# Altium project RobotShield.PrjPcb
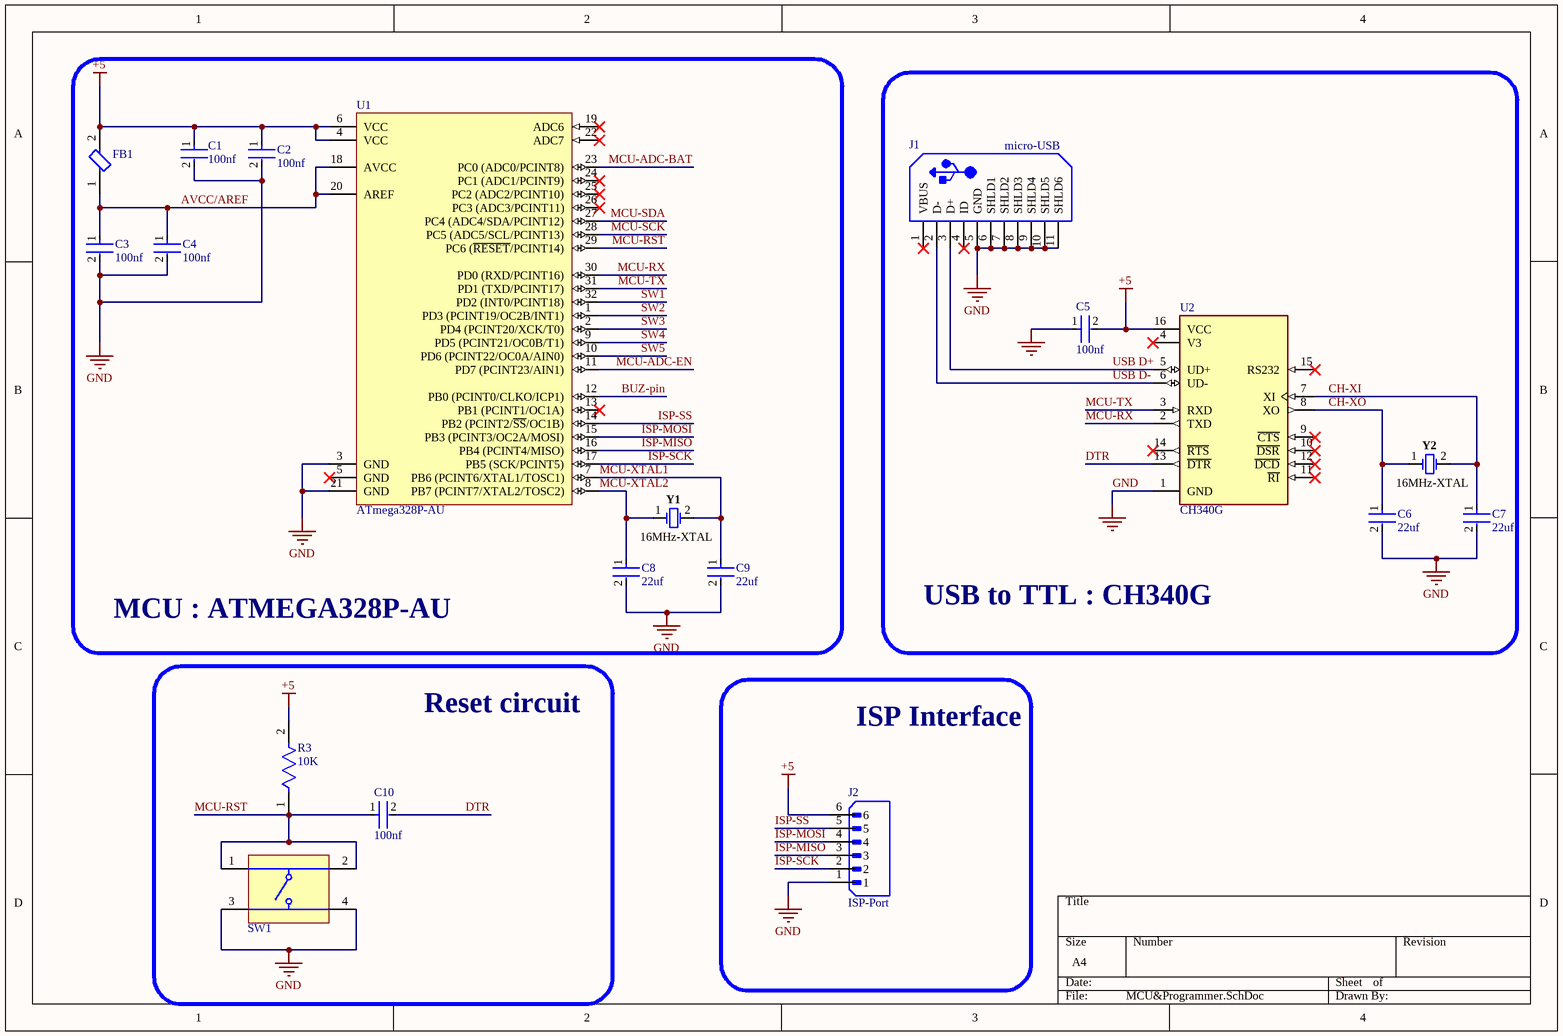
[diagram p0: MCU&Programmer.SchDoc]
3 sheets, 66 parts. Net scope: global (net labels, ports and power ports of the same name join across sheets).
Board file: RobotShield-PCB.PcbDoc
Sheets:
  MCU&Programmer.SchDoc
  Power-Supply.SchDoc
  peripherals.SchDoc

## Sheet MCU&Programmer.SchDoc
size A4; SheetNumber: 1; SheetTotal: 3

### Parts
C1  100nf  [FP-CC0805-0_85-MFG]
C2  100nf  [FP-CC0805-0_85-MFG]
C3  100nf  [FP-CC0805-0_85-MFG]
C4  100nf  [FP-CC0805-0_85-MFG]
C5  100nf  [FP-CC0805-0_85-MFG]
C6  22uf  [FP-CC0805-0_85-MFG]
C7  22uf  [FP-CC0805-0_85-MFG]
C8  22uf  [FP-CC0805-0_85-MFG]
C9  22uf  [FP-CC0805-0_85-MFG]
C10  100nf  [FP-CC0805-0_85-MFG]
FB1  (no value)  [FP-BLM21-0_2-t0_85-e0_5-IPC_B]
J1  micro-USB  [USB-MICRO-B_V]
J2  ISP-Port  [JST_B6B-XH-A(LF)(SN)]
R3  10K  [FP-CRCW0805-e3-MFG]
SW1  FSM4JSMATR  [TECO-FSM4JSMATR_V]  (value not drawn)
U1  ATmega328P-AU  [32A_M]
U2  CH340G  [SOIC127P600X180-16N]
Y1  16MHz-XTAL  [FOX-FOXSLF160-20]
Y2  16MHz-XTAL  [FOX-FOXSLF160-20]

### Blocks framed on the sheet
MCU : ATMEGA328P-AU: C1-C4 C8 C9 FB1 U1 Y1
USB to TTL : CH340G: C5-C7 J1 U2 Y2
Reset circuit: C10 R3 SW1
ISP Interface: J2

### Nets
+5: C1.1 C2.1 C5.2 FB1.2 J2.6 R3.2 U1.4(VCC) U1.6(VCC) U2.16(VCC)
GND: C1.2 C2.2 C3.2 C4.2 C5.1 C6.2 C7.2 C8.2 C9.2 J1.5(GND) J1.6(SHLD1) J1.7(SHLD2) J1.8(SHLD3) J1.9(SHLD4) J1.10(SHLD5) J1.11(SHLD6) J2.1 SW1.3 SW1.4 U1.3(GND) U1.21(GND) U2.1(GND)
AVCC/AREF: C3.1 C4.1 FB1.1 U1.18(AVCC) U1.20(AREF)
BUZ-pin: U1.12(PB0_(PCINT0/CLKO/ICP1))
CH-XI: C7.1 U2.7(XI) Y2.2
CH-XO: C6.1 U2.8(XO) Y2.1
DTR: C10.2 U2.13(~{DTR})
ISP-MISO: J2.3 U1.16(PB4_(PCINT4/MISO))
ISP-MOSI: J2.4 U1.15(PB3_(PCINT3/OC2A/MOSI))
ISP-SCK: J2.2 U1.17(PB5_(SCK/PCINT5))
ISP-SS: J2.5 U1.14(PB2_(PCINT2/~{SS}/OC1B))
MCU-ADC-BAT: U1.23(PC0_(ADC0/PCINT8))
MCU-ADC-EN: U1.11(PD7_(PCINT23/AIN1))
MCU-RST: C10.1 R3.1 SW1.1 SW1.2 U1.29(PC6_(~{RESET}/PCINT14))
MCU-RX: U1.30(PD0_(RXD/PCINT16)) U2.2(TXD)
MCU-SCK: U1.28(PC5_(ADC5/SCL/PCINT13))
MCU-SDA: U1.27(PC4_(ADC4/SDA/PCINT12))
MCU-TX: U1.31(PD1_(TXD/PCINT17)) U2.3(RXD)
MCU-XTAL1: C9.1 U1.7(PB6_(PCINT6/XTAL1/TOSC1)) Y1.2
MCU-XTAL2: C8.1 U1.8(PB7_(PCINT7/XTAL2/TOSC2)) Y1.1
SW1: U1.32(PD2_(INT0/PCINT18))
SW2: U1.1(PD3_(PCINT19/OC2B/INT1))
SW3: U1.2(PD4_(PCINT20/XCK/T0))
SW4: U1.9(PD5_(PCINT21/OC0B/T1))
SW5: U1.10(PD6_(PCINT22/OC0A/AIN0))
USB D+: J1.3(D+) U2.5(UD+)
USB D-: J1.2(D-) U2.6(UD-)

Not connected (* = marked no-connect by the designer): J1 1(VBUS)* 4(ID)*; U1 5(GND)* 13(PB1_(PCINT1/OC1A))* 19(ADC6)* 22(ADC7)* 24(PC1_(ADC1/PCINT9))* 25(PC2_(ADC2/PCINT10))* 26(PC3_(ADC3/PCINT11))*; U2 4(V3)* 9(~{CTS})* 10(~{DSR})* 11(~{RI})* 12(~{DCD})* 14(~{RTS})* 15(RS232)*

### Library data of the parts
C1-C5 C10 = CMP-2100-03606-3: CAP CER 0.1UF 50V X7R 0805; Manufacturer Part Number: CC0805KRX7R9BB104; Manufacturer: Yageo; Tolerance: 0.1; Material: Ceramic; Device Class L1: Passive Components; ComponentLink2Description: Datasheet; Package: CC0805-0.85; Digikey Description: CAP CER 0.1UF 50V X7R 0805; Capacitance: 100 nF; Device Class L3: Ceramic Capacitors; Value: 100 nF; Temperature: -30°C to +85°C; Temperature Characteristic: X7R; Voltage Rating: 50 V; Height: 0.95mm; RoHS: TRUE; Ipc Land Pattern Name: CAPC200125X85; Device Class L2: Capacitors; Category: Cap; Temperature Range Low: -30°C; Temperature Range High: +85°C; Mouser Description: Multilayer Ceramic Capacitors MLCC - SMD/SMT 100nF 50V X7R 10%; Footprint Url: http://www.yageo.com/exep/pages/download/literatures/UPY-C_GEN_24.pdf; Automotive: No; Octopart: https://octopart.com/cc0805krx7r9bb104-yageo-192993; Lead Free: Yes; ComponentLink2URL: http://www.yageo.com/documents/recent/UPY-GPHC_Y5V_6.3V-to-50V_8.pdf
C6-C9 = CMP-2100-03606-3: CAP CER 0.1UF 50V X7R 0805; Manufacturer Part Number: CC0805KRX7R9BB104; Manufacturer: Yageo; Tolerance: 0.1; Capacitance: 100 nF; Value: 100 nF; Material: Ceramic; Device Class L1: Passive Components; ComponentLink2Description: Datasheet; Package: CC0805-0.85; Digikey Description: CAP CER 0.1UF 50V X7R 0805; Device Class L3: Ceramic Capacitors; Temperature: -30°C to +85°C; Temperature Characteristic: X7R; Voltage Rating: 50 V; Height: 0.95mm; RoHS: TRUE; Ipc Land Pattern Name: CAPC200125X85; Device Class L2: Capacitors; Category: Cap; Temperature Range Low: -30°C; Temperature Range High: +85°C; Mouser Description: Multilayer Ceramic Capacitors MLCC - SMD/SMT 100nF 50V X7R 10%; Footprint Url: http://www.yageo.com/exep/pages/download/literatures/UPY-C_GEN_24.pdf; Automotive: No; Octopart: https://octopart.com/cc0805krx7r9bb104-yageo-192993; Lead Free: Yes; ComponentLink2URL: http://www.yageo.com/documents/recent/UPY-GPHC_Y5V_6.3V-to-50V_8.pdf
FB1 = CMP-0686-00610-3: Chip Ferrite Bead, 0805, 220Ω @ 100MHz, 0.045Ω, 25%, 2A; Number of Circuits: 1; Shielding: Unshielded; DC Resistance (DCR): 45mR; Impedance: 220R; Radiation Hardening: No; Material: Ferrite; Frequency: 100MHz; Width: 1.25mm; DC Current: 2A; Max DC Current: 2A; Number of Lines: 1; Package Quantity: 1; Case Code (Metric): 2012; Current Rating: 2A; Case/Package: 0805; Current: 2A; Military Standard: Not; Core Material: Ferrite; Depth: 1.25mm; Contact Plating: Tin; DC Resistance-Max: 45mR; Max Operating Temperature: 125°C; Length: 2mm; Max Current Rating: 2A; REACH SVHC: No SVHC; Termination: SMD/SMT; Min Operating Temperature: -55°C; Series: BLM21P; Test Frequency: 100MHz; Tolerance: 25%; Number of Pins: 2; RoHS Compliant: Yes; Height: 0.85mm; Packaging: Tape and Reel; Lead Free: Lead Free; Case Code (Imperial): 0805
J1 = CMP-2000-05827-1: Micro-USB B Receptacle, Right Angle, Bottom Mount, Surface Mount, with Solder Tabs, -30 to 85 degC, 5-Pin USB, RoHS, Tape and Reel; Manufacturer: Molex; Featured Product: Micro-USBConnectorsUSBConnectors; Other Names: WM1399DKR; Package Version: Rev. F, 12/2012; Number of Contacts: 5; Connector Type: USB-microB; Catalog Drawings: 1050170001; 3D Model: 105017-0001.stp; Mating Products: WM17145-ND-CABLEMICROUSBBTOSTDA1.0MWM17147-ND-CABLEMICROUSBBTOSTDA2.0MWM17146-ND-CABLEMICROUSBBTOSTDA1.5M; PCN Assembly/Origin: ResinSupplier21/Oct/2015; Voltage - Max: 30V; Online Catalog: Molex-MicroUSB; Manufacturer URL: http://www.molex.com/; Package Description: 5-Leads USB, Micro B, Body 7.5 x 5 mm, Pitch 0.65 mm; Datasheet URL: http://www.molex.com/elqNow/elqRedir.htm?ref=http://www.molex.com/webdocs/datasheets/pdf/en-us/1050170001_IO_CONNECTORS.pdf; Ingress Protection: -; Datasheet Version: 03/2016; Mounting Type: BoardCutout,SurfaceMount,RightAngle; Circuits: 5; Standard Package: 1; Package Reference: MICRO-B; Package URL: http://www.molex.com/pdm_docs/sd/1050170001_sd.pdf; Category: Connectors,Interconnects; Series: -; RoHS Information: 1050170001CertofCompliance; Features: Shielded,SolderRetention; Family: USB,DVI,HDMIConnectors; Specifications: -; Gender: Receptacle; Packaging: Digi-Reel®; Mounting Technology: SurfaceMount
J2 = B6B-XH-A(LF)(SN): Connector Header Through Hole 6 position 0.098 (2.50mm); MF: JST Sales; SnapEDA_Link: https://www.snapeda.com/parts/B6B-XH-A(LF)(SN)/JST+Sales+America+Inc./view-part/?ref=snap; Package: None; Value: *; MP: B6B-XH-A(LF)(SN); Check_prices: https://www.snapeda.com/parts/B6B-XH-A(LF)(SN)/JST+Sales+America+Inc./view-part/?ref=eda
R3 = CMP-2001-04899-2: RES Thick Film, 100kΩ, 1%, 0.125W, 100ppm/°C, 0805; Resistance: 100kR; Power Rating: 125mW; Voltage Rating: 150V; Case/Package: 0805; Max Operating Temperature: 155°C; Case Code (Imperial): 0805; Lead Free: Lead Free; Weight: 0.000194oz; Number of Pins: 2; Package Quantity: 5000; Height: 0.45mm; Composition: Thick Film; Military Standard: Not; Tolerance: 1%; Case Code (Metric): 2012; Termination: SMD/SMT; Mount: Surface Mount; Radiation Hardening: No; Width: 1.25mm; Length: 2mm; Depth: 1.25mm; Packaging: Tape and Reel; Min Operating Temperature: -55°C; Contact Plating: Tin; Temperature Coefficient: 100ppm/°C; Voltage Rating (DC): 150V
SW1 = CMP-2000-07486-1: Micro Miniature Push Button Switch FSM JSM, 50 mA, -35 to 85 degC, 4-Pin SMD, RoHS, Tape and Reel; Manufacturer: TE Connectivity; Mechanical Life: 100000Cycles; Current Rating: 50mA; Actuator Material: Polyamide; Max Voltage Rating (DC): 12V; Capacitance: 0f; Illumination Type: Illuminated; Voltage Rating (DC): 24V; Case\/Package: SMD/SMT; Operating Force: 160gf; Contact Resistance: 100mOhm; Actuator Length: 0.055inch; Switch Travel: 0.25mm; Throw Configuration: SPST; Termination: GullWing; Contact Plating: Silver; Orientation: Straight; Mounting Technology: SurfaceMount; REACH SVHC: Unknown; Electrical Life: 100000Cycles; Package Reference: FSM4JSMATR; Max Operating Temperature: 85degC; Manufacturer URL: http://www.te.com/; Package Description: 4-Pin Surface Mount Device, Body 6 x 6 mm, Pitch 4.5 mm; Datasheet Version: Rev. V, 02/2015; Packaging: TapeandReel; Min Operating Temperature: -35degC; Mount: SurfaceMount; Contact Current Rating: 50mA; Contact Material: CopperAlloy; Package Quantity: 1200; Datasheet URL: http://www.te.com/commerce/DocumentDelivery/DDEController?Action=showdoc&DocId=Customer+Drawing%7F2-1437565-7%7FV%7Fpdf%7FEnglish%7FENG_CD_2-1437565-7_V.pdf%7F4-1437565-2; RoHSCompliant: true
U1 = CMP-0095-00269-2: 8-bit AVR Microcontroller, 32KB Flash, 1KB EEPROM, 2KB SRAM, 32-pin TQFP, Industrial Grade (-40°C to 85°C); PackageDescription: 32-Lead, 7x7x1.0 mm Body, 0.8mm Lead Pitch, Thin Profile Plastic Quad Flat Package (TQFP); DatasheetVersion: revD, May-2011; RevisionNote: DatasheetVersion & PackageVersion updated. URLs added.; ComponentLink1URL: http://www.atmel.com/; ComponentLink2Description: ATmega48A/48PA/88A/88PA/168A/168PA/328/328P Datasheet; Code_JEDEC: MS-026-ABA; ComponentLink1Description: Manufacturer URL; PackageReference: 32A; ComponentLink3Description: ATmega48A/48PA/88A/88PA/168A/168PA/328/328P Summary; ComponentLink2URL: http://www.atmel.com/dyn/resources/prod_documents/doc8271.pdf; PackageVersion: revC, Oct-2010; ComponentLink3URL: http://www.atmel.com/dyn/resources/prod_documents/8271S.pdf
U2 = CH340G: USB Interface Integrated Circuit; MF: WCH; Value: *; SnapEDA_Link: https://www.snapeda.com/parts/Ch340G/WCH/view-part/?ref=snap; MP: Ch340G; Check_prices: https://www.snapeda.com/parts/Ch340G/WCH/view-part/?ref=eda; Availability: Not in stock; Price: None; Package: None
Y1 Y2 = CMP-1749-00003-1: Resistance Weld Thru-Hole Crystal, 16 MHz, -20 to 70 degC, 2-Pin THD, RoHS, Bulk; Voltage Rating: 250 V; Tolerance: 1%; Resistance: 221 kohm; Case\Package: Axial; Power Rating: 250 mW; RoHSCompliant: true; Package Quantity: 200; Packaging: Bulk; Min Operating Temperature: -55 degC; DatasheetVersion: Mar-15; ComponentLink1URL: http://www.foxonline.com/; Max Operating Temperature: 155 degC; PackageReference: FOXSLF160-20; Mount: Through Hole; PackageDescription: 2-Pin Through Hole Device, Body 11.35 x 4.65 mm; ComponentLink1Description: Manufacturer URL; ComponentLink2URL: http://www.foxonline.com/pdfs/hc49slf.pdf; ComponentLink2Description: Datasheet; Length: 0.248 inch

## Sheet Power-Supply.SchDoc
size A; SheetNumber: 2; SheetTotal: 3
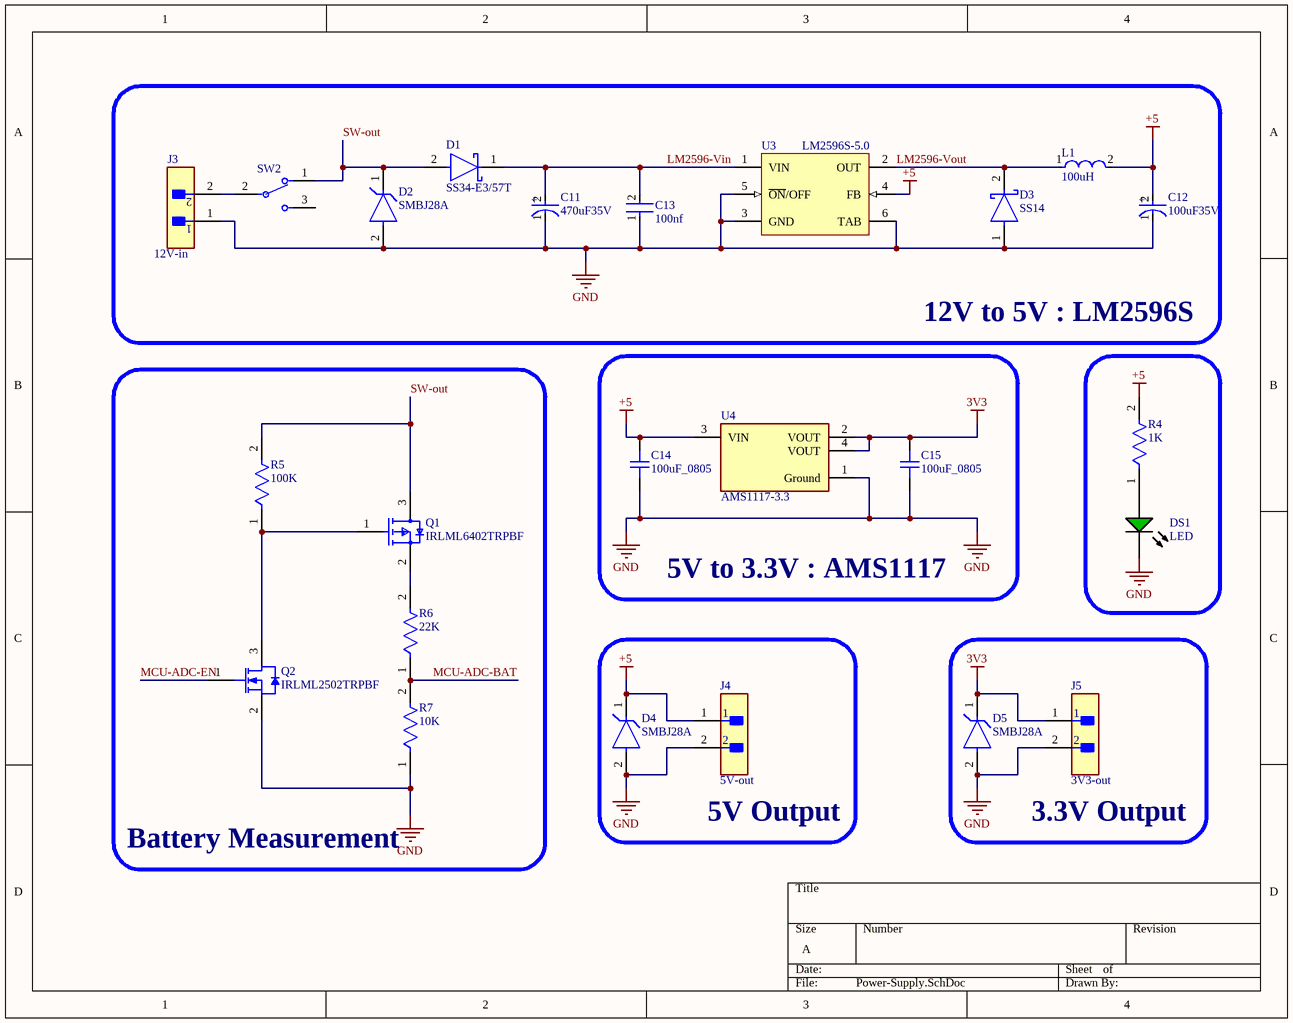
[diagram p1: Power-Supply.SchDoc]

### Parts
C11  470uF35V  [FP-RAD-TH-D_10_0_5-L_16_1-MFG]
C12  100uF35V  [FP-RAD-TH-D_10_0_5-L_16_1-MFG]
C13  100nf  [FP-CC0805-0_85-MFG]
C14  100uF_0805  [CAP_0805]
C15  100uF_0805  [CAP_0805]
D1  SS34-E3/57T  [FP-95402-MFG]
D2  SMBJ28A  [FP-SMBJ-MFG]
D3  SS14  [FP-403AE-MFG]
D4  SMBJ28A  [FP-SMBJ-MFG]
D5  SMBJ28A  [FP-SMBJ-MFG]
DS1  LED  [AVAG-HSMX-C170_V]
J3  12V-in  [FP-B2B-XH-A_LF_SN-MFG]
J4  5V-out  [FP-B2B-XH-A_LF_SN-MFG]
J5  3V3-out  [FP-B2B-XH-A_LF_SN-MFG]
L1  100uH  [FP-B82464G4-MFG]
Q1  IRLML6402TRPBF  [FP-Micro3-MFG]
Q2  IRLML2502TRPBF  [INTR-SOT-23-3_V]
R4  1K  [FP-CRCW0805-e3-MFG]
R5  100K  [FP-CRCW0805-e3-MFG]
R6  22K  [FP-CRCW0805-e3-MFG]
R7  10K  [FP-CRCW0805-e3-MFG]
SW2  JS102011SCQN  [FP-JS102011SCQN-MFG]  (value not drawn)
U3  LM2596S-5.0  [KTT0005B_M]
U4  AMS1117-3.3  [FP-AMS1117-IPC_C]

### Blocks framed on the sheet
12V to 5V : LM2596S: C11-C13 D1-D3 J3 L1 SW2 U3
Battery Measurement: Q1 Q2 R5-R7
5V to 3.3V : AMS1117: C14 C15 U4
5V Output: D4 J4
3.3V Output: D5 J5

### Nets
3V3: C15.2 D5.1(C) J5.1 U4.2(VOUT) U4.4(VOUT)
+5: C12.2(A) C14.2 D4.1(C) J4.1 L1.2 R4.2 U3.4(FB) U4.3(VIN)
GND: C11.1(C) C12.1(C) C13.1 C14.1 C15.1 D2.2(A) D3.1(A) D4.2(A) D5.2(A) DS1.2(K) J3.1 J4.2 J5.2 Q2.2(S) R7.1 U3.3(GND) U3.5(~{ON}/OFF) U3.6(TAB) U4.1(Ground)
LM2596-Vin: C11.2(A) C13.2 D1.1(C) U3.1(VIN)
LM2596-Vout: D3.2(C) L1.1 U3.2(OUT)
MCU-ADC-BAT: R6.1 R7.2
MCU-ADC-EN: Q2.1(G)
SW-out: D1.2(A) D2.1(C) Q1.3(D) R5.2 SW2.1
NetDS1_1: DS1.1(A) R4.1
NetJ3_2: J3.2 SW2.2(C)
NetQ1_1: Q1.1(G) Q2.3(D) R5.1
NetQ1_2: Q1.2(S) R6.2

Not connected (* = marked no-connect by the designer): SW2 3

### Notes on the sheet
- (in symbol CMP-05427-001499-1) +

### Library data of the parts
C11 C12 = CMP-05427-001499-1: Aluminum Electrolytic Capacitors (Radial Lead Type) AEC-Q200 Qualified 470uF ±20% 35V; Lead Diameter: 0.6mm; Lead/Base Style: Straight; Polarity: Polar; Life (Hours): 2000Hour; Ripple Current: 460mA; Tolerance: 20%; Termination: Radial; Contact Plating: Tin; Length: 16mm; Voltage Rating: 35V; Max Operating Temperature: 105°C; Construction: RADIAL; Voltage Rating (DC): 35V; Radiation Hardening: No; Packaging: Tape and Reel; Diameter: 10mm; Series: NHG; Case/Package: Radial; Mount: Through Hole; Lead Pitch: 5mm; Height: 16mm; RoHS Compliant: Yes; Height - Seated (Max): 0.669inch; Min Operating Temperature: -55°C; Package Quantity: 500; Capacitance: 470uF
C13 = CMP-2100-03606-3: as C1 on sheet MCU&Programmer; Device Class L1: Passive Components; ComponentLink2Description: Datasheet; Package: CC0805-0.85; Digikey Description: CAP CER 0.1UF 50V X7R 0805; Capacitance: 100 nF; Device Class L3: Ceramic Capacitors; Value: 100 nF; Temperature: -30°C to +85°C; Temperature Characteristic: X7R; Voltage Rating: 50 V; Height: 0.95mm; RoHS: TRUE; Ipc Land Pattern Name: CAPC200125X85; Device Class L2: Capacitors; Category: Cap; Temperature Range Low: -30°C; Temperature Range High: +85°C; Mouser Description: Multilayer Ceramic Capacitors MLCC - SMD/SMT 100nF 50V X7R 10%; Footprint Url: http://www.yageo.com/exep/pages/download/literatures/UPY-C_GEN_24.pdf; Automotive: No; Octopart: https://octopart.com/cc0805krx7r9bb104-yageo-192993; Lead Free: Yes; ComponentLink2URL: http://www.yageo.com/documents/recent/UPY-GPHC_Y5V_6.3V-to-50V_8.pdf
C14 C15 = CAP_0805_10V: Capacitor SMD 0805 10V
D1 = CMP-02539-000012-1: DIODE SCHOTTKY 40V 3A DO214AB; Manufacturer: Vishay; Max Junction Temp: +150°C; Peak Reverse Current: 0.5mA; Max Surge Forward Current: 100A; Standoff Height: 0mm; ComponentLink2Description: Datasheet; Device Class L3: Schottky Diodes; Height: 2.62mm; Max Repetitive Reverse Voltage: 40V; Lead Free: Yes; Package: 95402; Temperature Range High: +150°C; ComponentLink2URL: http://www.vishay.com/docs/88751/ss32.pdf; Temperature: -55°C to +150°C; Footprint Url: http://www.vishay.com/docs/95402/smc.pdf; Automotive: No; Forward Current: 3A; Category: Diode; Manufacturer Part Number: SS34-E3/57T; RoHS: TRUE; Device Class L2: Diodes; Mouser Description: Schottky Diodes & Rectifiers 3.0 Amp 40 Volt; Octopart: https://octopart.com/ss34-e3%2F57t-vishay-39552907; Temperature Range Low: -55°C; Device Class L1: Discrete Semiconductors; Digikey Description: DIODE SCHOTTKY 40V 3A DO214AB
D2 D4 D5 = CMP-08607-000081-1: TVS DIODE 28V 45.4V DO214AA; Manufacturer: Littelfuse Inc; Breakdown Voltage: 31.1V; Direction: Unidirectional; Number Of Channels: 1; Peak Pulse Power: 600W; Max Junction Temp: +150°C; Peak Pulse Current: 13.3A; Temperature: -65°C to +150°C; Category: Diode; RoHS: TRUE; Height: 2.61mm; Reverse Standoff Voltage: 28V; Device Class L1: Circuit Protection; Temperature Range Low: -65°C; ComponentLink2Description: Datasheet; Digikey Description: TVS DIODE 28V 45.4V DO214AA; Automotive: No; Package: SMBJ; Mouser Description: Littelfuse SMBJ28A, Uni-Directional TVS Diode, 600W, 2-Pin DO-214AA; ComponentLink2URL: https://www.littelfuse.com/~/media/electronics/datasheets/tvs_diodes/littelfuse_tvs_diode_smbj_datasheet.pdf.pdf; Manufacturer Part Number: SMBJ28A; Octopart: https://octopart.com/smbj28a-littelfuse-350790; Clamping Voltage: 45.4V; Temperature Range High: +150°C; Device Class L3: unset; Device Class L2: TVS Diodes; Lead Free: Yes
D3 = CMP-2000-04943-2: DIODE SCHOTTKY 40V 1A SMA; Manufacturer: ON Semiconductor; Peak Reverse Current: 0.2mA; Max Junction Temp: +125°C; Standoff Height: 0.05mm; Max Surge Forward Current: 40A; Mouser Description: Schottky Diodes & Rectifiers SMA 40V 1.0A; RoHS: TRUE; Lead Free: Yes; Manufacturer Part Number: SS14; Device Class L3: Schottky Diodes; Category: Diode; Automotive: No; Digikey Description: DIODE SCHOTTKY 40V 1A SMA; ComponentLink2Description: Datasheet; Device Class L2: Diodes; Height: 2.5mm; Temperature Range High: +125°C; ComponentLink2URL: https://www.onsemi.com/pub/Collateral/SS19-D.PDF; Device Class L1: Discrete Semiconductors; Package: 403AE; Octopart: https://octopart.com/ss14-on+semiconductor-29205033; Max Repetitive Reverse Voltage: 40V; Temperature Range Low: -65°C; Forward Current: 1A; Temperature: -65°C to +125°C
DS1 = CMP-2000-05062-1: Chip LED, Green, 2.2 V, -40 to 85 degC, 2-Pin SMD, Pb-Free, Tape and Reel; Manufacturer: Avago; No. of Pins: 2; Peak Wavelength: 570nm; SVHC: NoSVHC(16-Jun-2014); Dominant Wavelength: 572nm; Forward Current If: 20mA; Viewing Angle: 170deg; Lens Shape: Rectangular; PIV Max: 5V; External Width: 1.25mm; LED Type: Standard; External Depth: 0.8mm; Opto Mounting Orientation: Top; Luminous Intensity: 15mcd; Luminous Intensity Min: 4mcd; Forward Voltage VF Max: 2.6V; External Length / Height: 2mm; Bulb Size: 1.25mmx1.4mm; Light Area Height: 1mm; Voltage Vf Typ: 2.2V; Operating Temperature Max: 85degC; Datasheet Version: Oct-08; MSL: MSL2A-4weeks; Peak Forward Current: 20mA; Package Description: 2-Pin Surface Mount Device, Body 2 x 1.25 mm, Height 0.8 mm; Datasheet URL: https://datasheet.ciiva.com/29280/180495-da-01-en-chip-led-hsmg-c170-gelb-gruen-29280971.pdf; Storage Temperature Min: -40degC; LED Colour: Green; Wavelength Typ: 570nm; Mounting Type: SMD; Forward Current If Max: 20mA; Dominant Wavelength Typ: 572nm; LED Mounting: SMD; Operating Temperature Range: -30degCto+85degC; Operating Temperature Min: -30degC; Manufacturer URL: http://www.avagotech.com/; Packaging: CutTape; Luminous Intensity Typ: 15mcd; Package Reference: HSMX-C170; Storage Temperature Max: 85degC; Opto Case Style: SMD; Forward Voltage: 2.2V
J3-J5 = CMP-2000-05888-3: CONN HEADER VERT 2POS 2.5MM; Current Rating: 3A; Voltage Rating: 250V; Number of Contacts: 2; Contact Resistance: 20mR; Wire/Cable Gauge: 22AWG; Insulation Resistance: 1GR; Connector Type: Male Pin; Packaging: Bulk; Contact Material: Brass; Lead Free: Lead Free; Orientation: Straight; Contact Plating: Tin; Max Current Rating: 3A; Termination: Solder; Fastening Type: Detent; Depth: 5.75mm; Housing Material: Polyamide; REACH SVHC: No SVHC; Series: XH; Voltage Rating (AC): 250V; Number of Positions: 2; Color: Natural; Contact Type: Male Pin; Max Voltage Rating (DC): 250V; Pitch: 2.5mm; Lead Pitch: 2.5mm; Mount: Through Hole; Max Operating Temperature: 85°C; Length: 7.4mm; Max Voltage Rating (AC): 250V; Min Operating Temperature: -25°C; Number of Rows: 1; Housing Color: White
L1 = CMP-10464-000001-1: FIXED IND 68UH 1.3A 130 MOHM SMD; Manufacturer: EPCOS; Manufacturer Part Number: B82464G4683M000; Test Frequency: 100kHz; Automotive Grade: Grade 0; Series Resistance: 0.13Ω; Tolerance: 20%; Core Material: Ferrite; Saturation Current: 1.45A; Standoff Height: 0.21mm; Shielding: true; Temperature Range High: +150°C; ComponentLink2Description: Datasheet; Category: Ind; Height: 4.8mm; Device Class L1: Passive Components; Octopart: https://octopart.com/b82464g4683m000-epcos-23277316; Value: 68uH; RoHS: TRUE; Composition: Wirewound; Temperature: -55°C to +150°C; Inductance: 68uH; Package: B82464G4; Device Class L3: Fixed Inductors; Temperature Range Low: -55°C; Automotive: Yes; ComponentLink2URL: https://www.tdk-electronics.tdk.com/inf/30/db/ind_2008/b82464g4.pdf; Lead Free: Yes; Device Class L2: Inductors; Digikey Description: FIXED IND 68UH 1.3A 130 MOHM SMD; Rms Current: 1.3A
Q1 = CMP-32901-000130-1: MOSFET P-CH 20V 3.7A SOT-23; Manufacturer: Infineon; Reverse Recovery Time: 29ns; Max Forward Diode Voltage: -1.2V; Input Capacitace At Vds: 633pF @ -10V; Drain To Source Resistance: 0.05Ω; Gate To Source Voltage: 12V; Max Junction Temp: +150°C; Pulse Drain Current: -22A; Threshold Vgs Min: -0.4V; Turn Off Delay Time: 588ns; Number Of Channels: 1; Power Dissipation: 1.3W; Turn On Delay Time: 350ns; Drain To Source Breakdown Voltage: -20V; Continuous Drain Current: -3.7A; Depletion Mode: False; Gate Charge At Vgs: 8nC @ -5V; Rthja Max: 75°C/W; Threshold Vgs: -0.55V; Standoff Height: 0.01mm; Reverse Recovery Charge: 11nC; Device Class L2: Transistors; Ipc Land Pattern Name: SOT95P237X100-3; Temperature Range High: +150°C; Octopart: https://octopart.com/irlml6402trpbf-infineon-65874989; ComponentLink2URL: https://www.infineon.com/dgdl/irlml6402pbf.pdf?fileId=5546d462533600a401535668d5c2263c; Automotive: No; Manufacturer Part Number: IRLML6402TRPBF; Height: 1.12mm; Drain To Source Voltage: -20V; Digikey Description: MOSFET P-CH 20V 3.7A SOT-23; Device Class L1: Discrete Semiconductors; Package: Micro3; Lead Free: Yes; Temperature Range Low: -55°C; Number Of P Channels: 1; Technology: MOSFET; Temperature: -55°C to +150°C; Category: Trans; Footprint Url: http://irf.com/package/outline/po_micro3.pdf; RoHS: TRUE; Device Class L3: MOSFETs; Threshold Vgs Max: -1.2V; ComponentLink2Description: Datasheet
Q2 = CMP-2000-04985-1: N-Channel HEXFET(R) Power MOSFET, 20 V VDS, +/- 12 V VGS, 4.2 A, 3-Pin SOT23, RoHS, Tape and Reel; Manufacturer: International Rectifier; Drain-to-Source Voltage [Vdss]: 20V; Drain-Source On Resistance-Max: 0.045O; Qg Gate Charge: 8nC; Rated Power Dissipation: 1.25W; Package Reference: SOT-23-3; Manufacturer URL: http://internationalrectifier.com/; Package Description: 3-Pin Small Outline Transistor, Body 2.92 x 1.3 mm, Pitch 0.95 mm; Datasheet Version: Apr-14; Channel Type: N-Channel; Datasheet URL: https://datasheet.ciiva.com/6383/irlml2502pbf-6383216.pdf
R4-R7 = CMP-2001-04899-2: as R3 on sheet MCU&Programmer; Case/Package: 0805; Max Operating Temperature: 155°C; Case Code (Imperial): 0805; Lead Free: Lead Free; Weight: 0.000194oz; Number of Pins: 2; Package Quantity: 5000; Height: 0.45mm; Composition: Thick Film; Military Standard: Not; Tolerance: 1%; Case Code (Metric): 2012; Termination: SMD/SMT; Mount: Surface Mount; Radiation Hardening: No; Width: 1.25mm; Length: 2mm; Depth: 1.25mm; Packaging: Tape and Reel; Min Operating Temperature: -55°C; Contact Plating: Tin; Temperature Coefficient: 100ppm/°C; Voltage Rating (DC): 150V
SW2 = CMP-10038-000023-1: SWITCH SLIDE SPDT 300MA 6V; Electrical Life: 5000Cycles; Actuator Type: Standard; Contact Resistance: 70mR; Actuator Material: Nylon; Max Voltage Rating (DC): 30V; Actuator Length: 2mm; Switch Function: On-On; Actuator Color: Black; Radiation Hardening: No; Throw Configuration: SPDT; Depth: 7.5mm; Case/Package: SMD/SMT; Package Quantity: 4000; Min Operating Temperature: -40°C; Length: 8.5mm; Current Rating: 300mA; Mount: Surface Mount; Voltage Rating (DC): 6V; RoHS Compliant: Yes; Orientation: Straight; Housing Material: Nylon; Contact Plating: Silver; Max Operating Temperature: 85°C; Packaging: Tape and Reel; Switch Travel: 2mm; Max Current Rating: 300mA; Contact Material: Copper Alloy; Series: JS; Termination: Gull Wing
U3 = CMP-0069-00269-3: SIMPLE SWITCHER® Power Converter 150 KHz 3A Step-Down Voltage Regulator, 5-pin TO-263, Pb-Free; Manufacturer: Texas Instruments; PowerWise: N; PackageTopMarking: NSUZXYTTE#*LM2596S*-5.0 P+; ComponentLink1URL: http://www.ti.com/general/docs/lit/getliterature.tsp?genericPartNumber=LM2596&fileType=pdf; PackageDescription: TO-263, Molded, .400 x .390 x .180in, 5 Lead, .067in Pitch, Surface Mount; RoHS: Y; PinCount: 5; Code_JEDEC: MO-169-AB; ComponentLink1Description: Datasheet URL; PackageReference: KTT0005B; CompType: Switcher
U4 = CMP-209535-000001-1: LDO Voltage Regulators 1A, 3.3V; Manufacturer: Advanced Monolithic Systems; Dropout Voltage: 1.1V; Output Type: Fixed; Nominal Supply Current: 5mA; Max Power Dissipation: 1.2W; Max Supply Voltage: 15V; Number Of Outputs: 1; Standoff Height: 0.64mm; Max Junction Temp: +125°C; Height: 1.8mm; Package: AMS1117; Device Class L2: Power Management ICs; ComponentLink2Description: Datasheet; ComponentLink2URL: http://www.advanced-monolithic.com/pdf/ds1117.pdf; Category: IC; RoHS: TRUE; Automotive: No; Device Class L1: Integrated Circuits (ICs); Output Current: 1A; Device Class L3: Voltage Regulators - Linear; Temperature: -40°C to +125°C; Output Voltage: 3.3V; Manufacturer Part Number: AMS1117-3.3; Temperature Range Low: -40°C; Octopart: https://octopart.com/ams1117-3.3-advanced+monolithic+systems-25899300; Lead Free: Yes; Ipc Land Pattern Name: SOT229P700X180-4; Temperature Range High: +125°C

## Sheet peripherals.SchDoc
size A; SheetNumber: 3; SheetTotal: 3
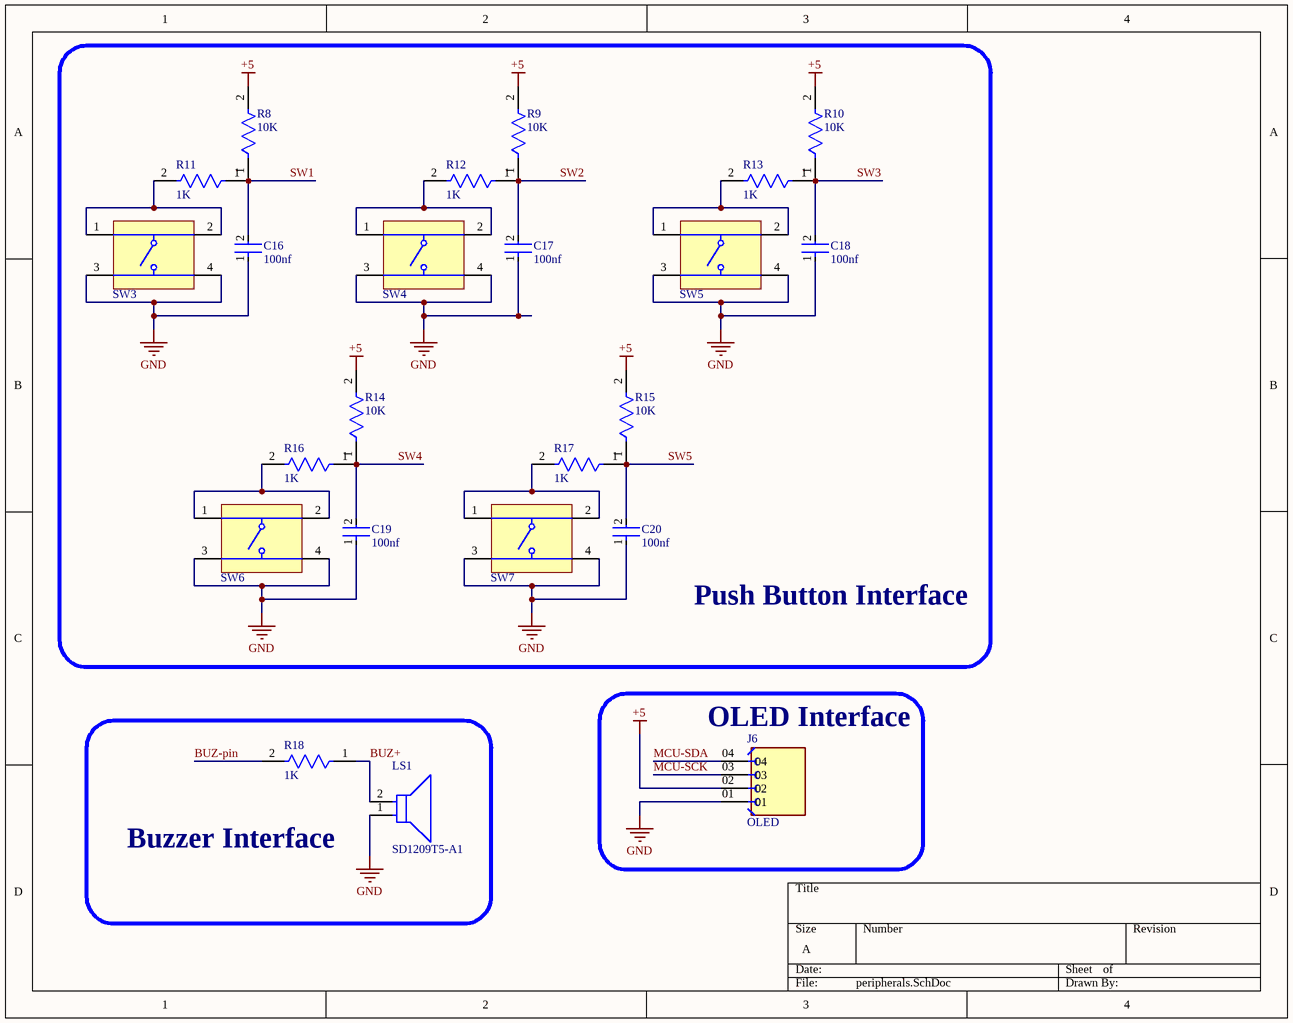
[diagram p2: peripherals.SchDoc]

### Parts
C16  100nf  [FP-CC0805-0_85-MFG]
C17  100nf  [FP-CC0805-0_85-MFG]
C18  100nf  [FP-CC0805-0_85-MFG]
C19  100nf  [FP-CC0805-0_85-MFG]
C20  100nf  [FP-CC0805-0_85-MFG]
J6  OLED  [AMPHENOL_75915-804]
LS1  SD1209T5-A1  [FP-SD1209-MFG]
R8  10K  [FP-CRCW0805-e3-MFG]
R9  10K  [FP-CRCW0805-e3-MFG]
R10  10K  [FP-CRCW0805-e3-MFG]
R11  1K  [FP-CRCW0805-e3-MFG]
R12  1K  [FP-CRCW0805-e3-MFG]
R13  1K  [FP-CRCW0805-e3-MFG]
R14  10K  [FP-CRCW0805-e3-MFG]
R15  10K  [FP-CRCW0805-e3-MFG]
R16  1K  [FP-CRCW0805-e3-MFG]
R17  1K  [FP-CRCW0805-e3-MFG]
R18  1K  [FP-CRCW0805-e3-MFG]
SW3  FSM4JSMATR  [TECO-FSM4JSMATR_V]  (value not drawn)
SW4  FSM4JSMATR  [TECO-FSM4JSMATR_V]  (value not drawn)
SW5  FSM4JSMATR  [TECO-FSM4JSMATR_V]  (value not drawn)
SW6  FSM4JSMATR  [TECO-FSM4JSMATR_V]  (value not drawn)
SW7  FSM4JSMATR  [TECO-FSM4JSMATR_V]  (value not drawn)

### Blocks framed on the sheet
Push Button Interface: C16-C20 R8-R17 SW3-SW7
Buzzer Interface: LS1 R18
OLED Interface: J6

### Nets
+5: J6.02 R8.2 R9.2 R10.2 R14.2 R15.2
GND: C16.1 C17.1 C18.1 C19.1 C20.1 J6.01 LS1.1(C) SW3.3 SW3.4 SW4.3 SW4.4 SW5.3 SW5.4 SW6.3 SW6.4 SW7.3 SW7.4
BUZ+: LS1.2(A) R18.1
BUZ-pin: R18.2
MCU-SCK: J6.03
MCU-SDA: J6.04
SW1: C16.2 R8.1 R11.1
SW2: C17.2 R9.1 R12.1
SW3: C18.2 R10.1 R13.1
SW4: C19.2 R14.1 R16.1
SW5: C20.2 R15.1 R17.1
NetR11_2: R11.2 SW3.1 SW3.2
NetR12_2: R12.2 SW4.1 SW4.2
NetR13_2: R13.2 SW5.1 SW5.2
NetR16_2: R16.2 SW6.1 SW6.2
NetR17_2: R17.2 SW7.1 SW7.2

### Library data of the parts
C16-C20 = CMP-2100-03606-3: as C1 on sheet MCU&Programmer; Device Class L1: Passive Components; ComponentLink2Description: Datasheet; Package: CC0805-0.85; Digikey Description: CAP CER 0.1UF 50V X7R 0805; Capacitance: 100 nF; Device Class L3: Ceramic Capacitors; Value: 100 nF; Temperature: -30°C to +85°C; Temperature Characteristic: X7R; Voltage Rating: 50 V; Height: 0.95mm; RoHS: TRUE; Ipc Land Pattern Name: CAPC200125X85; Device Class L2: Capacitors; Category: Cap; Temperature Range Low: -30°C; Temperature Range High: +85°C; Mouser Description: Multilayer Ceramic Capacitors MLCC - SMD/SMT 100nF 50V X7R 10%; Footprint Url: http://www.yageo.com/exep/pages/download/literatures/UPY-C_GEN_24.pdf; Automotive: No; Octopart: https://octopart.com/cc0805krx7r9bb104-yageo-192993; Lead Free: Yes; ComponentLink2URL: http://www.yageo.com/documents/recent/UPY-GPHC_Y5V_6.3V-to-50V_8.pdf
J6 = 75915-804: DuboxÂ® 2.54mm, Board to Board Connector,Vertical Receptacle, Through Hole, Single row , 4 Positions, 2.54mm (0.100in) Pitch.; MF: Amphenol; Price: None; Purchase-URL: https://pricing.snapeda.com/search/part/75915-804/?ref=eda; Value: *; Check_prices: https://www.snapeda.com/parts/75915-804/Amphenol/view-part/?ref=eda; Package: None; SnapEDA_Link: https://www.snapeda.com/parts/75915-804/Amphenol/view-part/?ref=snap; MP: 75915-804; Availability: In Stock
LS1 = CMP-08413-000009-1: AUDIO MAGNETIC XDCR 3-6V TH; Max Supply Current: 60mA; Number of Terminals/Pins: 2; Frequency: 2.048kHz; Washable: No; Operating Supply Voltage: 5V; Self Resonant Frequency: 2.05kHz; Min Operating Temperature: -40°C; Operating Supply Current: 60mA; Diameter: 12mm; Package Quantity: 100; Max Operating Temperature: 85°C; Sensing Method: Magnetic; Series: SD; Current Rating: 60mA; Lead Free: Lead Free; Height: 9mm; Packaging: Tray; Termination: PC Pins; Number of Pins: 2; Voltage Rating (DC): 5V; Mount: Through Hole
R8-R18 = CMP-2001-04899-2: as R3 on sheet MCU&Programmer; Case/Package: 0805; Max Operating Temperature: 155°C; Case Code (Imperial): 0805; Lead Free: Lead Free; Weight: 0.000194oz; Number of Pins: 2; Package Quantity: 5000; Height: 0.45mm; Composition: Thick Film; Military Standard: Not; Tolerance: 1%; Case Code (Metric): 2012; Termination: SMD/SMT; Mount: Surface Mount; Radiation Hardening: No; Width: 1.25mm; Length: 2mm; Depth: 1.25mm; Packaging: Tape and Reel; Min Operating Temperature: -55°C; Contact Plating: Tin; Temperature Coefficient: 100ppm/°C; Voltage Rating (DC): 150V
SW3-SW7 = CMP-2000-07486-1: as SW1 on sheet MCU&Programmer; Termination: GullWing; Contact Plating: Silver; Orientation: Straight; Mounting Technology: SurfaceMount; REACH SVHC: Unknown; Electrical Life: 100000Cycles; Package Reference: FSM4JSMATR; Max Operating Temperature: 85degC; Manufacturer URL: http://www.te.com/; Package Description: 4-Pin Surface Mount Device, Body 6 x 6 mm, Pitch 4.5 mm; Datasheet Version: Rev. V, 02/2015; Packaging: TapeandReel; Min Operating Temperature: -35degC; Mount: SurfaceMount; Contact Current Rating: 50mA; Contact Material: CopperAlloy; Package Quantity: 1200; Datasheet URL: http://www.te.com/commerce/DocumentDelivery/DDEController?Action=showdoc&DocId=Customer+Drawing%7F2-1437565-7%7FV%7Fpdf%7FEnglish%7FENG_CD_2-1437565-7_V.pdf%7F4-1437565-2; RoHSCompliant: true

## Nets that join several sheets
+5: MCU&Programmer (9 pins), Power-Supply (8 pins), peripherals (6 pins)
GND: MCU&Programmer (22 pins), Power-Supply (19 pins), peripherals (17 pins)
BUZ-pin: MCU&Programmer (U1.12), peripherals (R18.2)
MCU-ADC-BAT: MCU&Programmer (U1.23), Power-Supply (R6.1 R7.2)
MCU-ADC-EN: MCU&Programmer (U1.11), Power-Supply (Q2.1)
MCU-SCK: MCU&Programmer (U1.28), peripherals (J6.03)
MCU-SDA: MCU&Programmer (U1.27), peripherals (J6.04)
SW1: MCU&Programmer (U1.32), peripherals (C16.2 R8.1 R11.1)
SW2: MCU&Programmer (U1.1), peripherals (C17.2 R9.1 R12.1)
SW3: MCU&Programmer (U1.2), peripherals (C18.2 R10.1 R13.1)
SW4: MCU&Programmer (U1.9), peripherals (C19.2 R14.1 R16.1)
SW5: MCU&Programmer (U1.10), peripherals (C20.2 R15.1 R17.1)